# Altium schematic sheet S7CAS-PLEIADES-CARTE-MERE_Pxx_FLASH_PHY_CLOCK.SchDoc
size Tabloid; SheetNumber: 10; SheetTotal: 18; Sheet_Name: FLASH CLOCK; Size: 11x17
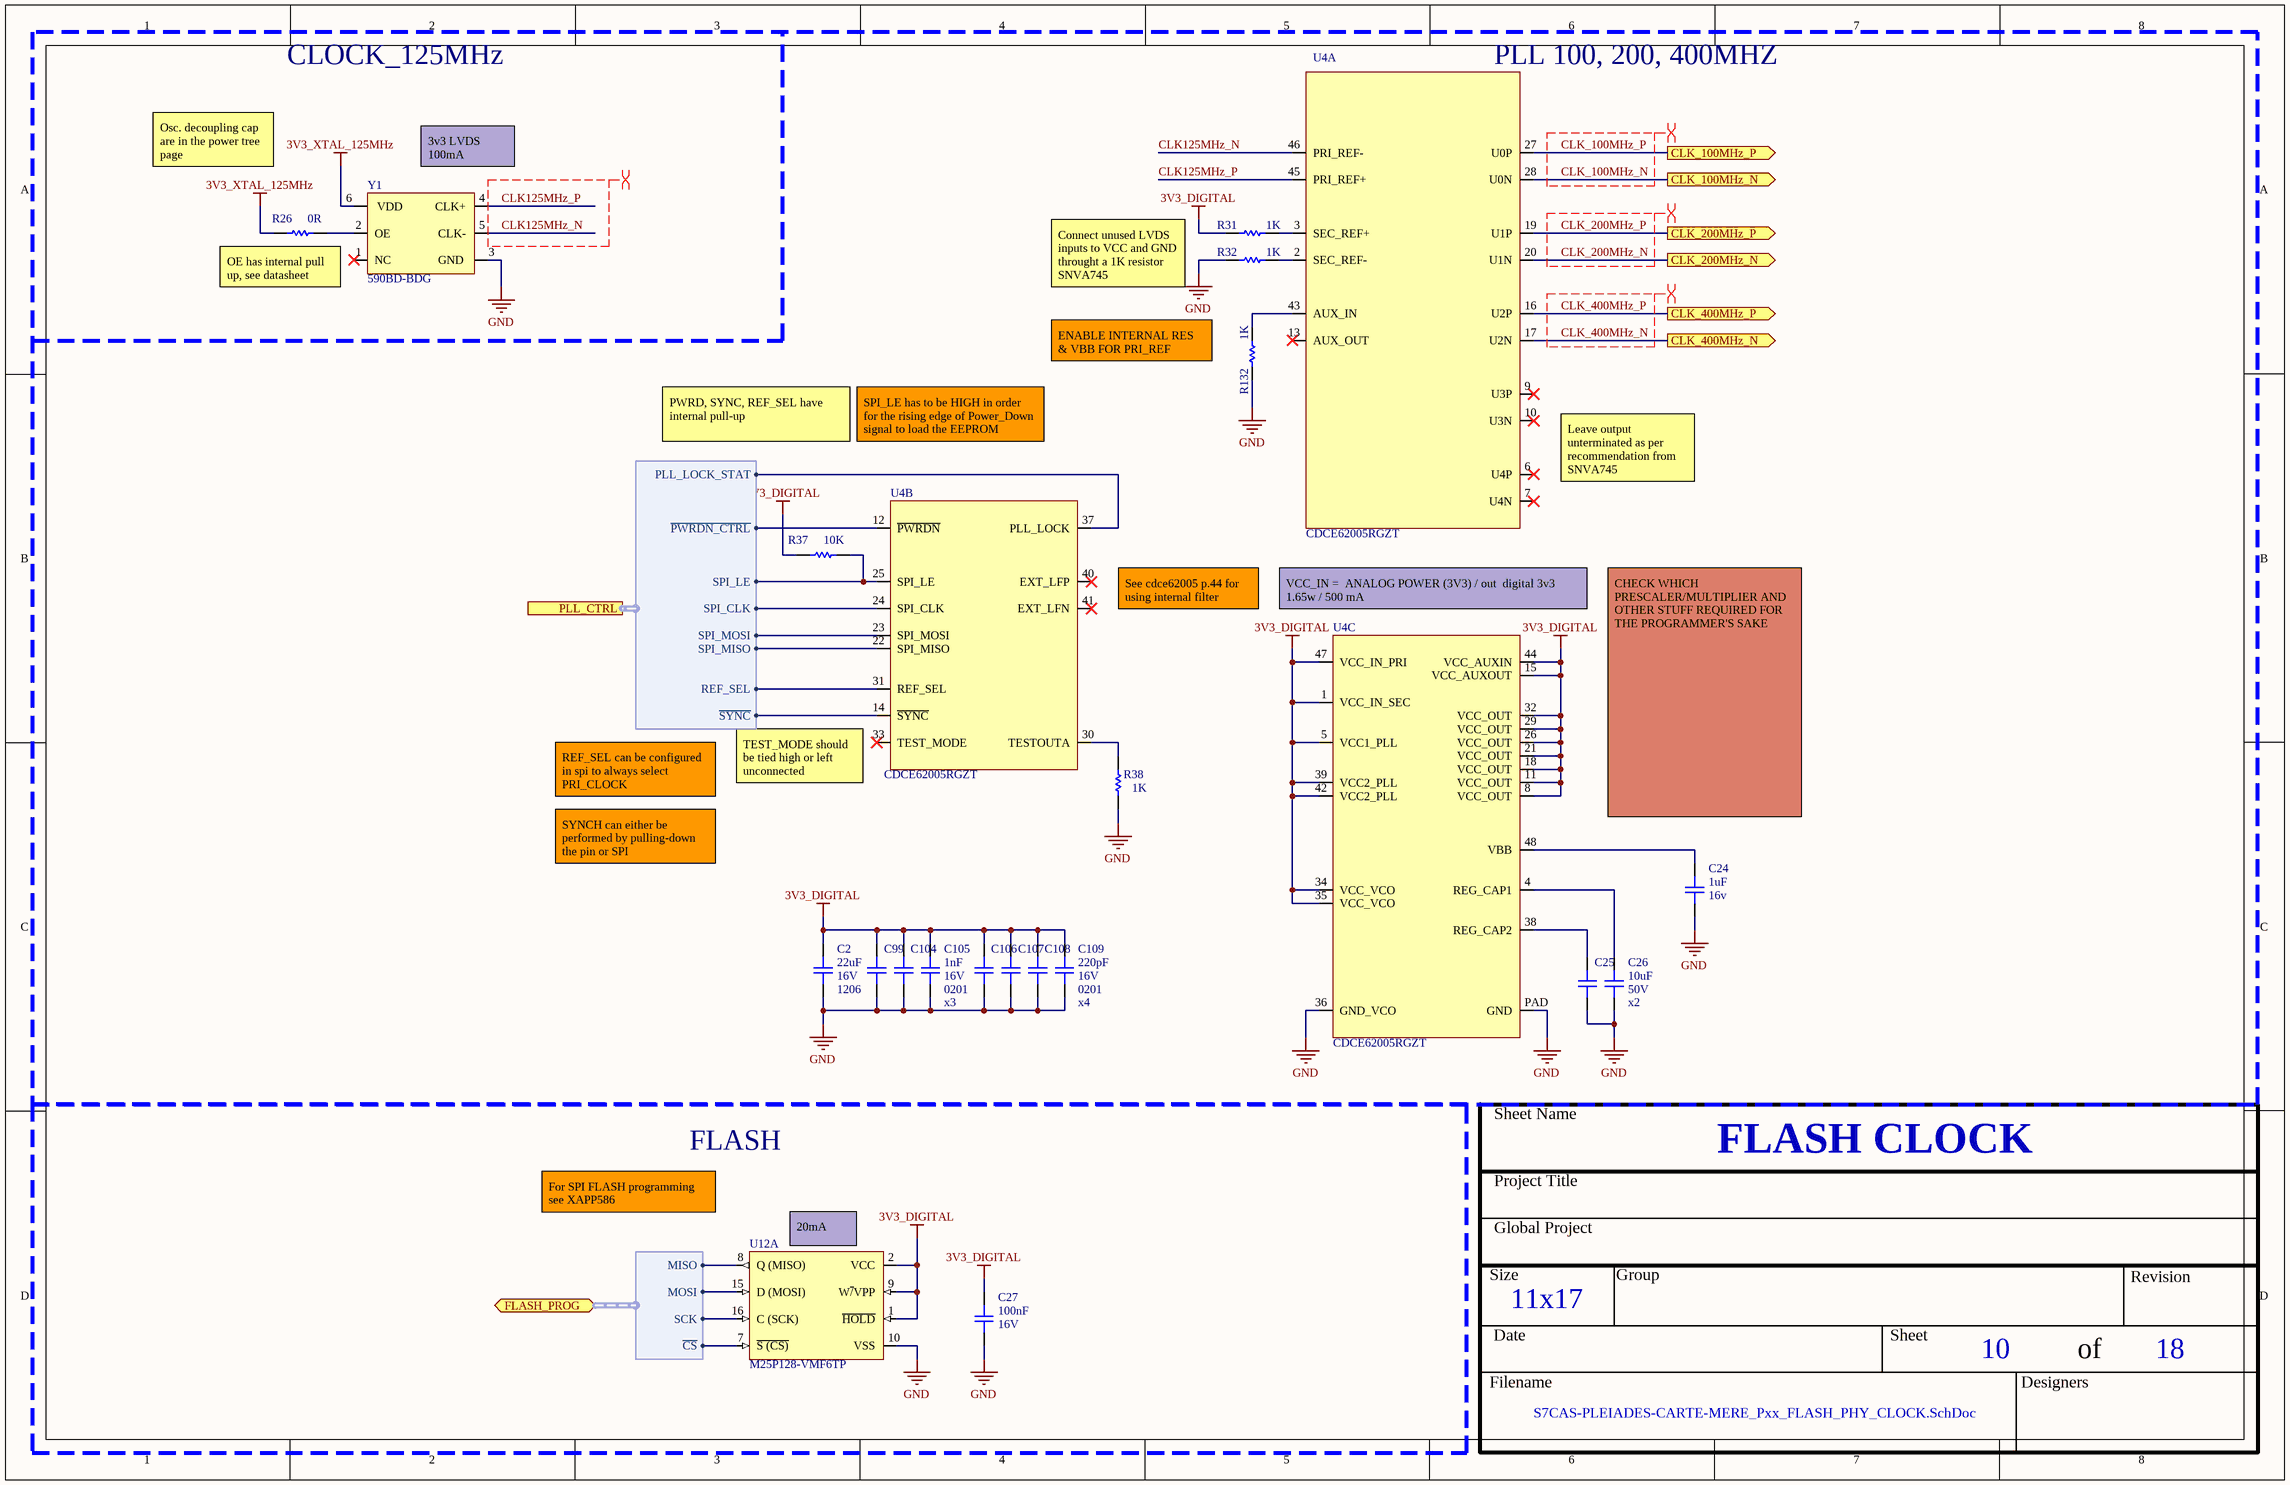
[diagram p0: S7CAS-PLEIADES-CARTE-MERE_Pxx_FLASH_PHY_CLOCK.SchDoc]

## Parts
C2  value 22uF  Voltage: 16V  Package: 1206  [CAP_1206]  (hidden comment: CAP - 1206)
C24  value 1uF  Voltage: 16v  [CAP_0603]  (hidden comment: CAP - 0603)
C25  CAP - 1206  [CAP_1206]  (value not drawn)
C26  value 10uF  Voltage: 50V  [CAP_1206]  (hidden comment: CAP - 1206)
C27  value 100nF  Voltage: 16V  [CAP_0603]  (hidden comment: CAP - 0603)
C99  CAP - 0201  [CAP_0201]  (value not drawn)
C104  CAP - 0201  [CAP_0201]  (value not drawn)
C105  value 1nF  Voltage: 16V  Package: 0201  [CAP_0201]  (hidden comment: CAP - 0201)
C106  CAP - 0201  [CAP_0201]  (value not drawn)
C107  CAP - 0201  [CAP_0201]  (value not drawn)
C108  CAP - 0201  [CAP_0201]  (value not drawn)
C109  value 220pF  Voltage: 16V  Package: 0201  [CAP_0201]  (hidden comment: CAP - 0201)
R26  value 0R  [RES_0603]  (hidden comment: RES - 0603)
R31  value 1K  [RES_0603]  (hidden comment: RES - 0603)
R32  value 1K  [RES_0603]  (hidden comment: RES - 0603)
R37  value 10K  [RES_0603]  (hidden comment: RES - 0603)
R38  value 1K  [RES_0603]  (hidden comment: RES - 0603)
R132  value 1K  [RES_0603]  (hidden comment: RES - 0603)
U4  CDCE62005RGZT  [TIM_CDCE62005RGZT]  (parts A,B,C of 3)
U12  M25P128-VMF6TP  [FLASH - M25P128-VMF6TP]  (part A of 2)
Y1  590BD-BDG  [OSC_590BD-BDG]

## Blocks framed on the sheet
FLASH: C27 U12

## Ports
CLK_100MHz_N (out, see S7CAS-PLEIADES-CARTE-MERE_Pxx_FPGA_bank0_1_5[3A]), CLK_100MHz_P (out, see S7CAS-PLEIADES-CARTE-MERE_Pxx_FPGA_bank0_1_5[3A]), CLK_200MHz_N (out, see S7CAS-PLEIADES-CARTE-MERE_Pxx_CAN[1C]), CLK_200MHz_P (out, see S7CAS-PLEIADES-CARTE-MERE_Pxx_CAN[1C]), CLK_400MHz_N (out, see S7CAS-PLEIADES-CARTE-MERE_Pxx_CNA[2C]), CLK_400MHz_P (out, see S7CAS-PLEIADES-CARTE-MERE_Pxx_CNA[2C]), FLASH_PROG (bidir, harness FLASH_PROG, see S7CAS-PLEIADES-CARTE-MERE_Pxx_FPGA_bank2_4[2D]), PLL_CTRL (harness PLL_CTRL, see S7CAS-PLEIADES-CARTE-MERE_Pxx_FPGA_bank0_1_5[1B])

## Harnesses
PLL_CTRL: ~{PWRDN_CTRL}, SPI_LE, SPI_CLK, SPI_MOSI, SPI_MISO, REF_SEL, ~{SYNC}, PLL_LOCK_STAT
FLASH_PROG: MISO, MOSI, SCK, ~{CS}

## Nets
3V3_DIGITAL: C2.2 C27.2 C99.2 C104.2 C105.2 C106.2 C107.2 C108.2 C109.2 R31.2 R37.2 U4.1(VCC_IN_SEC) U4.5(VCC1_PLL) U4.8(VCC_OUT) U4.11(VCC_OUT) U4.15(VCC_AUXOUT) U4.18(VCC_OUT) U4.21(VCC_OUT) U4.26(VCC_OUT) U4.29(VCC_OUT) U4.32(VCC_OUT) U4.34(VCC_VCO) U4.35(VCC_VCO) U4.39(VCC2_PLL) U4.42(VCC2_PLL) U4.44(VCC_AUXIN) U4.47(VCC_IN_PRI) U12.1(~{HOLD}) U12.2(VCC) U12.9(W~{/}VPP)
3V3_XTAL_125MHz: R26.2 Y1.6(VDD)
GND: C2.1 C24.1 C25.1 C26.1 C27.1 C99.1 C104.1 C105.1 C106.1 C107.1 C108.1 C109.1 R32.2 R38.1 R132.2 U4.36(GND_VCO) U4.PAD(GND) U12.10(VSS) Y1.3(GND)
CLK125MHz_N: U4.46(PRI_REF-) Y1.5(CLK-)
CLK125MHz_P: U4.45(PRI_REF+) Y1.4(CLK+)
CLK_100MHz_N: U4.28(U0N) ; port CLK_100MHz_N
CLK_100MHz_P: U4.27(U0P) ; port CLK_100MHz_P
CLK_200MHz_N: U4.20(U1N) ; port CLK_200MHz_N
CLK_200MHz_P: U4.19(U1P) ; port CLK_200MHz_P
CLK_400MHz_N: U4.17(U2N) ; port CLK_400MHz_N
CLK_400MHz_P: U4.16(U2P) ; port CLK_400MHz_P
NetC24_2: C24.2 U4.48(VBB)
NetC25_2: C25.2 U4.38(REG_CAP2)
NetC26_2: C26.2 U4.4(REG_CAP1)
NetR26_1: R26.1 Y1.2(OE)
NetR31_1: R31.1 U4.3(SEC_REF+)
NetR32_1: R32.1 U4.2(SEC_REF-)
NetR37_1: R37.1 U4.25(SPI_LE) ; port PLL_CTRL.SPI_LE
NetR38_2: R38.2 U4.30(TESTOUTA)
NetR132_1: R132.1 U4.43(AUX_IN)
NetU4_12: U4.12(~{PWRDN}) ; port PLL_CTRL.~{PWRDN_CTRL}
NetU4_14: U4.14(~{SYNC}) ; port PLL_CTRL.~{SYNC}
NetU4_22: U4.22(SPI_MISO) ; port PLL_CTRL.SPI_MISO
NetU4_23: U4.23(SPI_MOSI) ; port PLL_CTRL.SPI_MOSI
NetU4_24: U4.24(SPI_CLK) ; port PLL_CTRL.SPI_CLK
NetU4_31: U4.31(REF_SEL) ; port PLL_CTRL.REF_SEL
NetU4_37: U4.37(PLL_LOCK) ; port PLL_CTRL.PLL_LOCK_STAT
NetU12_7: U12.7(~{S_(CS)}) ; port FLASH_PROG.~{CS}
NetU12_8: U12.8(Q_(MISO)) ; port FLASH_PROG.MISO
NetU12_15: U12.15(D_(MOSI)) ; port FLASH_PROG.MOSI
NetU12_16: U12.16(C_(SCK)) ; port FLASH_PROG.SCK

Not connected (* = marked no-connect by the designer): U4 6(U4P)* 7(U4N)* 9(U3P)* 10(U3N)* 13(AUX_OUT)* 33(TEST_MODE)* 40(EXT_LFP)* 41(EXT_LFN)*; Y1 1(NC)*

## Layout directives
differential pair; differential pair class LVDS_125MHz; net class CLK_125MHz: CLK125MHz_N, CLK125MHz_P
differential pair; differential pair class CLK_100MHz_PAIR: CLK_100MHz_N, CLK_100MHz_P
differential pair; differential pair class CLK_200MHz_PAIR: CLK_200MHz_N, CLK_200MHz_P
differential pair; differential pair class CLK_400MHz_PAIR: CLK_400MHz_N, CLK_400MHz_P

## Notes on the sheet
- CLOCK_125MHz
- PLL 100, 200, 400MHZ
- Osc. decoupling cap are in the power tree page
- (near Y1) 3v3 LVDS 100mA
- (near R26) OE has internal pull up, see datasheet
- Connect unused LVDS inputs to VCC and GND throught a 1K resistor
  SNVA745
- (near R132) ENABLE INTERNAL RES & VBB FOR PRI_REF
- PWRD, SYNC, REF_SEL have internal pull-up
- SPI_LE has to be HIGH in order for the rising edge of Power_Down signal to load the EEPROM
- (near U4) Leave output unterminated as per recommendation from SNVA745
- (near U4) See cdce62005 p.44 for using internal filter
- VCC_IN =  ANALOG POWER (3V3) / out  digital 3v3
  1.65w / 500 mA
- REF_SEL can be configured in spi to always select PRI_CLOCK
- (near U4) TEST_MODE should be tied high or left unconnected
- CHECK WHICH PRESCALER/MULTIPLIER AND OTHER STUFF REQUIRED FOR THE PROGRAMMER'S SAKE
- SYNCH can either be performed by pulling-down the pin or SPI
- x3
- (near C109) x4
- (near C26) x2
- For SPI FLASH programming see XAPP586
- (near U12) 20mA
- Sheet Name
- Project Title
- Global Project
- Size
- Group
- Revision
- Date
- Sheet
- of
- Filename
- Designers

## Library data of the parts
C2 C26 = CAP - 1206: Precision: 10%; Current: *; CreatedBy: Jonathan Bouchard; Power: *
  C2: Supplier 1: Arrow Electronics; Supplier Part Number 1: CL31A226MOCLNNC
  C26: Package: 1206; Supplier 1: Avnet; Supplier Part Number 1: CL31A106MBHNNNE
C24 C27 = CAP - 0603: Precision: 10%; Current: *; CreatedBy: Jonathan Bouchard; Power: *; Package: 0603; Supplier 1: Arrow Electronics
  C24: Supplier Part Number 1: CL10B105MO8NNWC
  C27: Supplier Part Number 1: CL10B104KO8NNNC
C25 = CAP - 1206: Precision: 10%; Voltage: 50V; Value: 10uF; Current: *; CreatedBy: Jonathan Bouchard; Power: *; Package: 1206; Supplier 1: Avnet; Supplier Part Number 1: CL31A106MBHNNNE
C99 C104 = CAP - 0201: Precision: 10%; Voltage: 16V; Value: 1nF; Current: *; CreatedBy: Jonathan Bouchard; Power: *; Package: 0201; Supplier 1: Avnet; Supplier Part Number 1: GRM033R71C102KA01J
C105 C109 = CAP - 0201: Precision: 10%; Current: *; CreatedBy: Jonathan Bouchard; Power: *
  C105: Supplier 1: Avnet; Supplier Part Number 1: GRM033R71C102KA01J
  C109: Supplier 1: Arrow Electronics; Supplier Part Number 1: GRM033R71C221KA01D
C106-C108 = CAP - 0201: Precision: 10%; Voltage: 16V; Value: 220pF; Current: *; CreatedBy: Jonathan Bouchard; Power: *; Package: 0201; Supplier 1: Arrow Electronics; Supplier Part Number 1: GRM033R71C221KA01D
R26 R31 R32 R37 R38 R132 = RES - 0603: Precision: 1%; Current: *; CreatedBy: Jonathan Bouchard; Package: 0603
  R26: Supplier 1: Arrow Electronics; Supplier Part Number 1: RMCF0603ZT0R00
  R31 R32 R132: Supplier 1: Mouser; Supplier Part Number 1: 71-CRCW0603-10K-E3
  R37: Supplier 1: Arrow Electronics; Supplier Part Number 1: RMCF0603FT10K0
  R38: Supplier 1: Arrow Electronics; Supplier Part Number 1: RMCF0603FT1K00
U4 = TIM_CDCE62005RGZT: TIM - CLK SYNTH JITTER CLEANER 3:5 - QFN-48; Voltage: 3 V ~ 3.6 V; Mfg: Texas Instruments; Current: *; Power: *; Mfg Part Number: CDCE62005RGZT; HelpURL: http://www.ti.com/lit/ds/symlink/cdce62005.pdf; CreatedBy: Jonathan Bouchard; Temperature: -40°C ~ 85°C; Value: *; Precision: *; Package: QFN-48; Supplier 1: Digikey; Supplier Part Number 1: 296-23947-1-ND
U12 = FLASH  - M25P128-VMF6TP: 128-Mbit, low-voltage, serial flash memory / with 54-MHz SPI bus interface; GRAMS Lib Spec: 2.7; Supplier 1: Digikey; Supplier Part Number 1: M25P128-VMF6TP CT-ND
Y1 = OSC_590BD-BDG: TIM - OSC PROG 125MHz ~ 214.999MHz LVDS 3.3V 7PPM EN/DS - 6-SMD; Manufacturer #1: Silicon Labs; Current Rating: 100 mA (supply); Note: Spécifié la fréquence lors de la commande; Voltage rating: 3.3V (supply); Polarized: Yes; Value: ±7ppm (freq Stability), ±20ppm (freq stability total); Magnetic Material: UNKNOWN; GRAMS Lib Spec: 2.8; Manufacturer #2: *; Power Max: *; Part Number #1: 590BD-BDG; Part Number #2: *; HelpURL: https://www.silabs.com/documents/public/data-sheets/Si590-591.pdf; Supplier 1: Digi-Key; Supplier Part Number 1: 590BD-BDG-ND; Assembly Type: SMD; Temperature: -40°C ~ 85°C; Package: 6-SMD; CreatedBy/Date: from 590BD-CDG; Tolerance: *; VerifiedBy: Caroline Paulin / 3/10/2019; Cryo: UNKNOWN